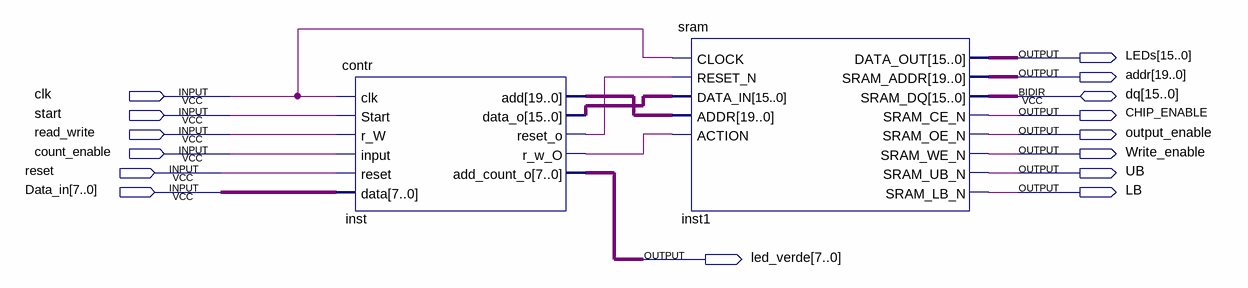
[diagram p0: schematic sheet]
// Quartus schematic block1.bdf as structural Verilog: 2 symbols, 15 pins
module block1 (
  input  clk,
  input  start,
  input  read_write,
  input  count_enable,
  input  reset,
  input  [7:0] Data_in,
  inout  [15:0] dq,
  output [15:0] LEDs,
  output [19:0] addr,
  output CHIP_ENABLE,
  output output_enable,
  output Write_enable,
  output UB,
  output LB,
  output [7:0] led_verde
);

  wire inst_r_w_o, inst_reset_o;
  wire [15:0] inst_data_o;
  wire [19:0] inst_add;

  contr inst (
    .clk(clk), .Start(start), .r_W(read_write), .\input (count_enable), .reset(reset), .data(Data_in),
    .add(inst_add), .data_o(inst_data_o), .reset_o(inst_reset_o), .r_w_O(inst_r_w_o), .add_count_o(led_verde));
  sram inst1 (
    .CLOCK(clk), .RESET_N(inst_reset_o), .DATA_IN(inst_data_o), .ADDR(inst_add), .ACTION(inst_r_w_o),
    .DATA_OUT(LEDs), .SRAM_ADDR(addr), .SRAM_CE_N(CHIP_ENABLE), .SRAM_OE_N(output_enable),
    .SRAM_WE_N(Write_enable), .SRAM_UB_N(UB), .SRAM_LB_N(LB), .SRAM_DQ(dq));
endmodule
